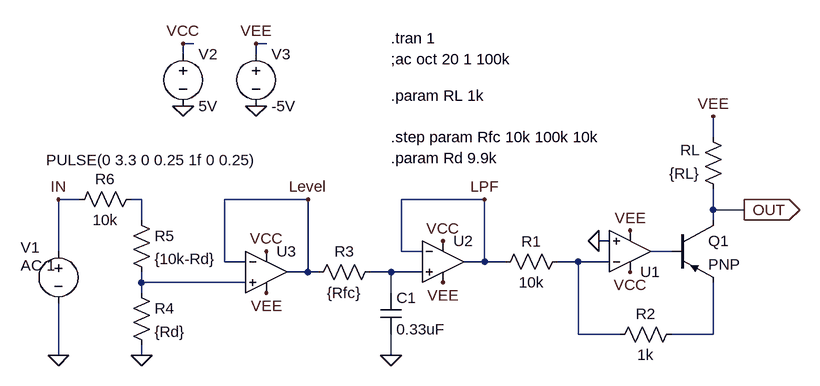
[diagram p0: schematic V-I Convert wLPF Att2.asc]
V-I Convert wLPF Att2.asc, the LTspice schematic file:
Version 4
SHEET 1 1132 680
WIRE -160 -160 -176 -160
WIRE -48 -160 -64 -160
WIRE -176 -144 -176 -160
WIRE -64 -144 -64 -160
WIRE 640 -16 640 -48
WIRE -336 80 -368 80
WIRE -240 80 -256 80
WIRE 16 80 -112 80
WIRE 288 80 160 80
WIRE 640 96 640 64
WIRE 688 96 640 96
WIRE -240 112 -240 80
WIRE 640 112 640 96
WIRE 480 144 464 144
WIRE -368 160 -368 80
WIRE 160 160 160 80
WIRE 192 160 160 160
WIRE 576 160 544 160
WIRE -112 176 -112 80
WIRE -80 176 -112 176
WIRE 288 176 288 80
WIRE 288 176 256 176
WIRE 320 176 288 176
WIRE 432 176 400 176
WIRE 480 176 432 176
WIRE 16 192 16 80
WIRE 16 192 -16 192
WIRE 32 192 16 192
WIRE 144 192 112 192
WIRE 192 192 144 192
WIRE -240 208 -240 192
WIRE -80 208 -240 208
WIRE -240 224 -240 208
WIRE 144 224 144 192
WIRE 432 288 432 176
WIRE 496 288 432 288
WIRE 640 288 640 208
WIRE 640 288 576 288
WIRE -368 320 -368 240
WIRE -240 320 -240 304
WIRE 144 320 144 288
FLAG 464 144 0
FLAG 512 192 VCC
FLAG 512 128 VEE
FLAG -368 320 0
FLAG -176 -64 0
FLAG -176 -160 VCC
FLAG -64 -64 0
FLAG -64 -160 VEE
FLAG -368 80 IN
FLAG 688 96 OUT
IOPIN 688 96 Out
FLAG 144 320 0
FLAG 224 144 VCC
FLAG 224 208 VEE
FLAG 640 -48 VEE
FLAG -240 320 0
FLAG -48 160 VCC
FLAG -48 224 VEE
FLAG 288 80 LPF
FLAG 16 80 Level
SYMBOL Opamps\\UniversalOpamp2 512 160 M180
SYMATTR InstName U1
SYMBOL res 416 160 R90
WINDOW 0 0 56 VBottom 2
WINDOW 3 32 56 VTop 2
SYMATTR InstName R1
SYMATTR Value 10k
SYMBOL res 592 272 R90
WINDOW 0 0 56 VBottom 2
WINDOW 3 32 56 VTop 2
SYMATTR InstName R2
SYMATTR Value 1k
SYMBOL pnp 576 112 R0
SYMATTR InstName Q1
SYMBOL res 656 80 R180
WINDOW 0 36 76 Left 2
WINDOW 3 36 40 Left 2
SYMATTR InstName RL
SYMATTR Value {RL}
SYMBOL voltage -368 144 R0
WINDOW 3 -19 -125 Left 2
WINDOW 123 -58 38 Left 2
WINDOW 39 0 0 Left 2
WINDOW 0 -58 10 Left 2
SYMATTR Value PULSE(0 3.3 0 0.25 1f 0 0.25)
SYMATTR Value2 AC 1
SYMATTR InstName V1
SYMBOL voltage -176 -160 R0
SYMATTR InstName V2
SYMATTR Value 5V
SYMBOL voltage -64 -160 R0
WINDOW 123 0 0 Left 2
WINDOW 39 0 0 Left 2
SYMATTR InstName V3
SYMATTR Value -5V
SYMBOL cap 128 224 R0
SYMATTR InstName C1
SYMATTR Value 0.33uF
SYMBOL res 128 176 R90
WINDOW 0 0 56 VBottom 2
WINDOW 3 32 56 VTop 2
SYMATTR InstName R3
SYMATTR Value {Rfc}
SYMBOL Opamps\\UniversalOpamp2 224 176 R0
SYMATTR InstName U2
SYMBOL res -256 208 R0
SYMATTR InstName R4
SYMATTR Value {Rd}
SYMBOL res -256 96 R0
SYMATTR InstName R5
SYMATTR Value {10k-Rd}
SYMBOL Opamps\\UniversalOpamp2 -48 192 R0
SYMATTR InstName U3
SYMBOL res -240 64 R90
WINDOW 0 0 56 VBottom 2
WINDOW 3 32 56 VTop 2
SYMATTR InstName R6
SYMATTR Value 10k
TEXT 144 -168 Left 2 !.tran 1
TEXT 144 -80 Left 2 !.param RL 1k
TEXT 144 -136 Left 2 !;ac oct 20 1 100k
TEXT 144 -16 Left 2 !.step param Rfc 10k 100k 10k
TEXT 144 16 Left 2 !.param Rd 9.9k

The netlist it stands for:
* V-I Convert wLPF Att2.asc
XU1 0 N003 VCC VEE N002 level.2 Avol=1Meg GBW=10Meg Slew=10Meg ilimit=25m rail=0 Vos=0 phimargin=45 en=0 enk=0 in=0 ink=0 Rin=500Meg  ; pins IN+ IN- V+ V- OUT
R1 N003 LPF 10k
R2 N006 N003 1k
Q1 OUT N002 N006 0 PNP
RL OUT VEE {RL}
V1 IN 0 PULSE(0 3.3 0 0.25 1f 0 0.25) AC 1
V2 VCC 0 5V
V3 VEE 0 -5V
C1 N004 0 0.33uF
R3 N004 Level {Rfc}
XU2 N004 LPF VCC VEE LPF level.2 Avol=1Meg GBW=10Meg Slew=10Meg ilimit=25m rail=0 Vos=0 phimargin=45 en=0 enk=0 in=0 ink=0 Rin=500Meg  ; pins IN+ IN- V+ V- OUT
R4 N005 0 {Rd}
R5 N001 N005 {10k-Rd}
XU3 N005 Level VCC VEE Level level.2 Avol=1Meg GBW=10Meg Slew=10Meg ilimit=25m rail=0 Vos=0 phimargin=45 en=0 enk=0 in=0 ink=0 Rin=500Meg  ; pins IN+ IN- V+ V- OUT
R6 N001 IN 10k
.model NPN NPN
.model PNP PNP
.lib standard.bjt
.tran 1
.param RL 1k
;ac oct 20 1 100k
.step param Rfc 10k 100k 10k
.param Rd 9.9k
.lib UniversalOpamps2.sub
.backanno
.end